# EasyEDA Pro project ProProject_Driver_STM32F405_2023-10-07.epro, board PCB1_4
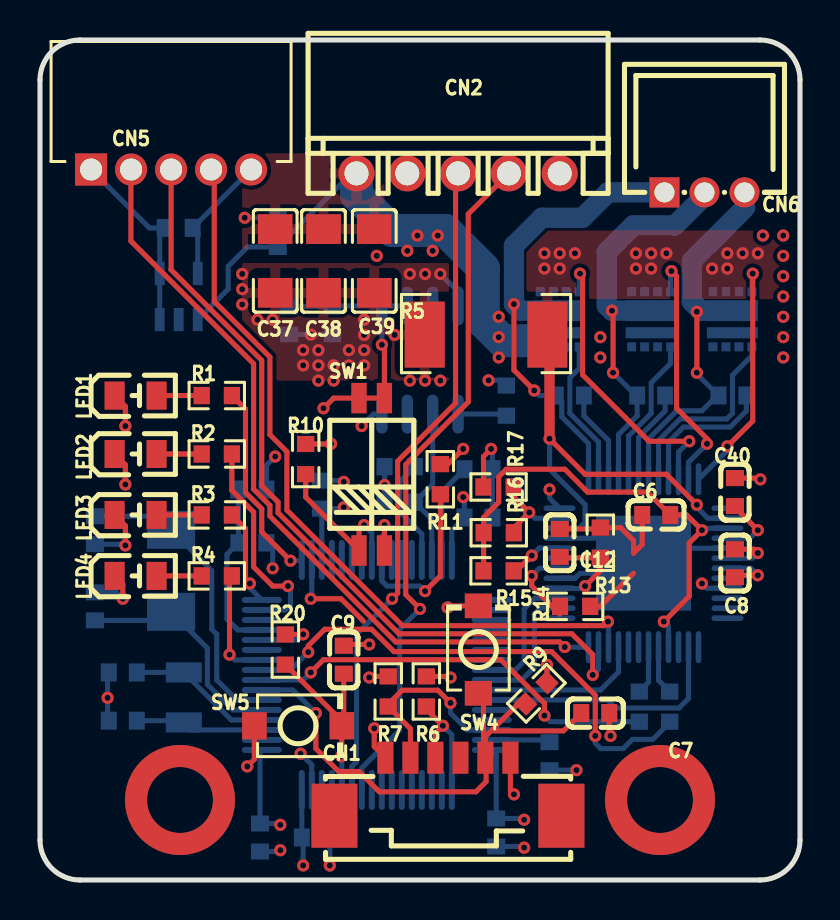
[diagram p8: board, top side]
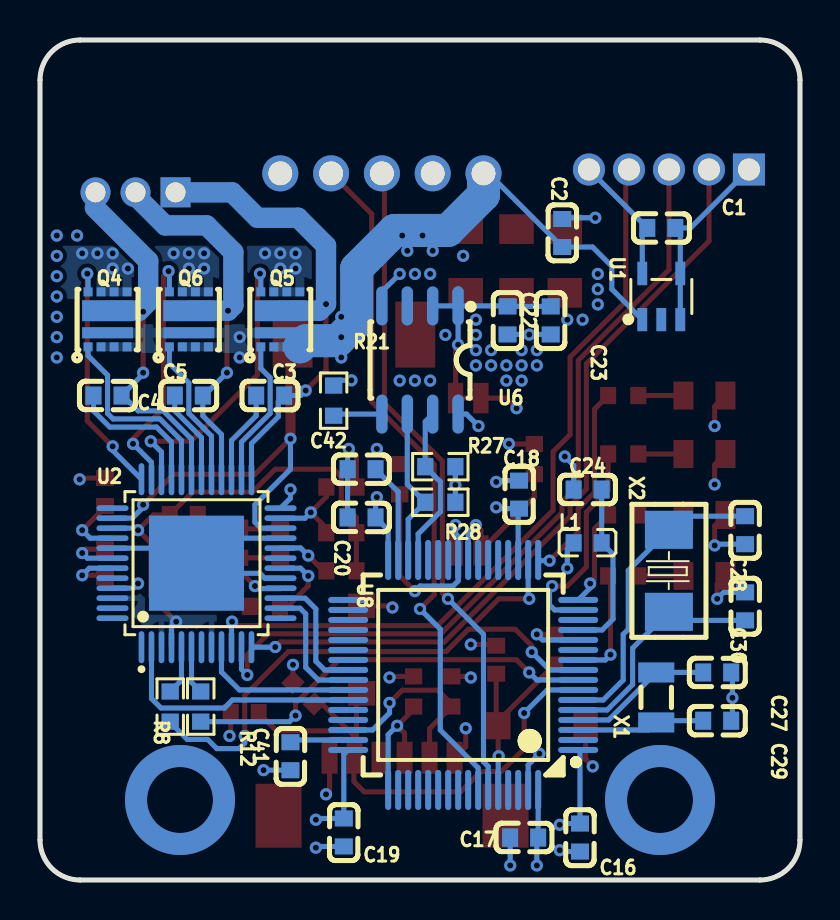
[diagram p9: board, bottom side, seen from below]

Outline 38 x 42 mm; copper layers: Top Layer, Inner1, Inner2, Bottom Layer. Coordinates in mm from the lower left corner of the outline.
Outline path: 0,40 0,2 arc(0.59,0.59) 2,0 36,0 arc(37.41,0.59) 38,2 38,40 arc(37.41,41.41) 36,42 2,42 arc(0.59,41.41) 0,40
Stack: Top Layer 0.035mm / Dielectric1 0.48mm PP er 4.5 / Inner1 0.035mm / Dielectric2 0.48mm FR4 er 4.5 / Inner2 0.035mm / Dielectric3 0.48mm PP er 4.5 / Bottom Layer 0.035mm

## Design rules (mm)
spacing safeClearance (default): track to track 0.152, other pairs 0.152 to 0.3
track width trackWidth (default): min 0.127, default 0.254, max 2.54
differential pair differentialPair (default): width min 0.127, default 0.254, max 2.54; gap min 0.152, default 0.152
via viaSize (default): diameter min 0.5, default 0.61, max 10; hole min 0.3, default 0.305, max 6
net GND uses copperRegion1
net VCC uses copperRegion1
net $1N23481 uses copperRegion1
net GND_CS uses copperRegion1
net +16V uses copperRegion1

## Placement (name value [footprint] x y rotation side)
C1  4.7uF  [C0603]  6.94 32.6 0 bottom
C2  10uF  [C0603]  11.89 32.35 270 bottom
C3  33nF  [C0603]  26.49 24.22 180 bottom
C4  33nF  [C0603]  34.62 24.22 180 bottom
C5  33nF  [C0603]  30.56 24.22 180 bottom
C6  1uF  [C0603]  30.81 18.25 0 top
C7  100nF  [C0603]  27.76 8.35 180 top
C8  470nF  [C0603]  34.75 15.84 270 top
C9  100nF  [C0603]  15.19 11.01 90 top
C12  1nF  [C0603]  25.99 16.86 270 top
C16  100nF  [C0603]  11 2.12 90 bottom
C17  100nF  [C0603]  13.79 2.12 180 bottom
C18  100nF  [C0603]  14.05 19.27 270 bottom
C19  100nF  [C0603]  22.81 2.38 90 bottom
C20  100nF  [C0603]  21.92 18.13 180 bottom
C22  10uF  [C0603]  14.62 27.98 90 bottom
C23  100nF  [C0603]  12.46 27.98 90 bottom
C24  100nF  [C0603]  10.62 19.52 180 bottom
C27  20pF  [C0603]  4.14 10.38 0 bottom
C28  20pF  [C0603]  2.74 17.49 90 bottom
C29  20pF  [C0603]  4.14 7.97 0 bottom
C30  20pF  [C0603]  2.74 13.68 270 bottom
C37  10uF  [C1206]  11.76 30.95 90 top
C38  10uF  [C1206]  14.17 30.95 90 top
C39  10uF  [C1206]  16.71 30.95 90 top
C40  1uF  [C0603]  34.75 19.4 90 top
C41  2.2uF  [C0603]  25.48 6.19 90 bottom
C42  2.2uF  [C0603]  21.92 20.54 180 bottom
CN1  532610671  [CONN-SMD_6P-P1.25_53261-0671]  20.4 4.66 0 top
CN2  5264-5AWD米色  [CONN-TH_5P-P2.50_5264-5AWD]  20.91 36.03 0 top
CN5  PH-5AW  [CONN-TH_5P-P2.00_PH-5AW_C2908637]  6.55 35.53 0 top
CN6  PH-3AW  [CONN-TH_3P-P2.00_HCTL_PH-3AW_C2908635]  33.22 34.38 180 top
L1  3.3uH  [L0603]  10.62 16.86 180 bottom
LED1  SZYY0805B  [LED0805-R-RD_BLUE]  4.78 24.22 0 top
LED2  SZYY0805B  [LED0805-R-RD_BLUE]  4.78 21.3 0 top
LED3  SZYY0805B  [LED0805-R-RD_BLUE]  4.78 18.25 0 top
LED4  SZYY0805B  [LED0805-R-RD_BLUE]  4.78 15.2 0 top
Q4  DMT3009LDT-7  [V-DFN3030-8K_L3.0-W3.0-P0.65-BL]  34.62 28.03 180 bottom
Q5  DMT3009LDT-7  [V-DFN3030-8K_L3.0-W3.0-P0.65-BL]  25.99 28.03 180 bottom
Q6  DMT3009LDT-7  [V-DFN3030-8K_L3.0-W3.0-P0.65-BL]  30.56 28.03 180 bottom
R1  1kΩ  [R0603]  8.84 24.22 0 top
R2  1kΩ  [R0603]  8.84 21.3 0 top
R3  1kΩ  [R0603]  8.84 18.25 0 top
R4  1kΩ  [R0603]  8.84 15.2 0 top
R5  25mΩ  [RES-SMD_L6.4-W3.2-R2512]  22.3 27.27 0 top
R6  10kΩ  [R0603]  19.32 9.43 270 top
R7  10kΩ  [R0603]  17.41 9.43 270 top
R8  1kΩ  [R0603]  31.49 8.67 90 bottom
R9  10kΩ  [R0603]  24.82 9.34 45 top
R10  806kΩ  [R0603]  13.28 21.05 90 top
R11  806kΩ  [R0603]  20.02 20.04 90 top
R12  1kΩ  [R0603]  29.96 8.67 90 bottom
R13  47kΩ  [R0603]  28.02 16.86 270 top
R14  10kΩ  [R0603]  26.76 13.68 0 top
R15  100kΩ  [R0603]  22.93 15.46 0 top
R16  100kΩ  [R0603]  22.94 17.36 0 top
R17  10kΩ  [R0603]  22.93 19.65 0 top
R20  10kΩ  [R0603]  12.27 11.52 90 top
R21  1kΩ  [R0603]  23.32 23.97 270 bottom
R27  10kΩ  [R0603]  17.98 20.67 180 bottom
R28  10kΩ  [R0603]  17.98 18.89 180 bottom
SW1  DSHP02TSGER  [SW-SMD_DSHP02TSGER]  16.59 20.28 0 top
SW4  TS-1088-AR02016  [SW-SMD_L3.9-W3.0-P4.45]  21.92 11.52 90 top
SW5  TS-1088-AR02016  [SW-SMD_L3.9-W3.0-P4.45]  12.9 7.71 0 top
U1  TPS7B6950DBVR  [SOT-23-5_L3.0-W1.7-P0.95-LS2.8-BL]  6.94 29.17 180 bottom
U2  A3930KJPTR-T  [LQFP-48_L7.0-W7.0-P0.50-LS9.0-BL-EP]  30.18 15.84 180 bottom
U6  AS5600-ASOT  [SOIC-8_L5.0-W4.0-P1.27-LS6.0-BL]  19 26 0 bottom
U8  STM32F405RGT6  [LQFP-64_L10.0-W10.0-P0.50-LS12.0-BL]  16.84 10.25 90 bottom
X1  32.768kHz  [FC-135R_L3.2-W1.5]  7.19 9.13 270 bottom
X2  8MHz  [CRYSTAL-SMD_L5.0-W3.2]  6.55 15.46 270 bottom

## Footprints (pads in the part's own frame, mm; a bottom-side part is the same pattern mirrored in y, then rotated)
C0603
  rect 0.8x0.9 smd: 1(-0.7,0) 2(0.7,0)
C1206
  rect 1.485x1.728 smd: 1(-1.593,0) 2(1.593,0)
CONN-SMD_6P-P1.25_53261-0671
  rect 0.8x1.6 smd: 1(3.124,1.45) 2(1.875,1.45) 3(0.625,1.45) 4(-0.625,1.45) 5(-1.875,1.45) 6(-3.124,1.45)
  rect 2.301x3.2 smd: 7(-5.675,-1.45) 8(5.675,-1.45)
CONN-TH_3P-P2.00_HCTL_PH-3AW_C2908635
  rect 1.5x1.5 hole 1: 1(2.001,0)
  round 1.5 hole 1: 2(0,0) 3(-2.001,0)
CONN-TH_5P-P2.00_PH-5AW_C2908637
  rect 1.6x1.6 hole 1.1: 1(-4,0)
  round 1.6 hole 1.1: 2(-2,0) 3(0,0) 4(2,0) 5(4,0)
CONN-TH_5P-P2.50_5264-5AWD
  round 1.801 hole 1.199: 1(-5.08,-0.701) 2(-2.54,-0.701) 3(0,-0.701) 4(2.54,-0.701) 5(5.08,-0.701)
CRYSTAL-SMD_L5.0-W3.2
  rect 1.9x2.4 smd: 1(-2.05,0) 2(2.05,0)
FC-135R_L3.2-W1.5
  rect 1x1.8 smd: 1(-1.25,0) 2(1.25,0)
L0603
  rect 0.8x0.864 smd: 1(-0.7,0) 2(0.7,0)
LED0805-R-RD_BLUE
  rect 1.001x1.399 smd: 1(1.052,0) 2(-1.049,0)
LQFP-48_L7.0-W7.0-P0.50-LS9.0-BL-EP
  oval 0.28x1.6 smd: 1(-2.75,-4.2) 2(-2.25,-4.2) 3(-1.75,-4.2) 4(-1.25,-4.2) 5(-0.75,-4.2) 6(-0.25,-4.2) 7(0.25,-4.2) 8(0.75,-4.2) 9(1.25,-4.2) 10(1.75,-4.2) 11(2.25,-4.2) 12(2.75,-4.2) 25(2.75,4.2) 26(2.25,4.2) 27(1.75,4.2) 28(1.25,4.2) 29(0.75,4.2) 30(0.25,4.2) 31(-0.25,4.2) 32(-0.75,4.2) 33(-1.25,4.2) 34(-1.75,4.2) 35(-2.25,4.2) 36(-2.75,4.2)
  oval 1.6x0.28 smd: 13(4.2,-2.75) 14(4.2,-2.25) 15(4.2,-1.75) 16(4.2,-1.25) 17(4.2,-0.75) 18(4.2,-0.25) 19(4.2,0.25) 20(4.2,0.75) 21(4.2,1.25) 22(4.2,1.75) 23(4.2,2.25) 24(4.2,2.75) 37(-4.2,2.75) 38(-4.2,2.25) 39(-4.2,1.75) 40(-4.2,1.25) 41(-4.2,0.75) 42(-4.2,0.25) 43(-4.2,-0.25) 44(-4.2,-0.75) 45(-4.2,-1.25) 46(-4.2,-1.75) 47(-4.2,-2.25) 48(-4.2,-2.75)
  rect 4.75x4.75 smd: 49(0,0)
LQFP-64_L10.0-W10.0-P0.50-LS12.0-BL
  oval 0.3x2 smd: 1(-3.75,-5.75) 2(-3.25,-5.75) 3(-2.75,-5.75) 4(-2.25,-5.75) 5(-1.75,-5.75) 6(-1.25,-5.75) 7(-0.75,-5.75) 8(-0.25,-5.75) 9(0.25,-5.75) 10(0.75,-5.75) 11(1.25,-5.75) 12(1.75,-5.75) 13(2.25,-5.75) 14(2.75,-5.75) 15(3.25,-5.75) 16(3.75,-5.75) 33(3.75,5.75) 34(3.25,5.75) 35(2.75,5.75) 36(2.25,5.75) 37(1.75,5.75) 38(1.25,5.75) 39(0.75,5.75) 40(0.25,5.75) 41(-0.25,5.75) 42(-0.75,5.75) 43(-1.25,5.75) 44(-1.75,5.75) 45(-2.25,5.75) 46(-2.75,5.75) 47(-3.25,5.75) 48(-3.75,5.75)
  oval 2x0.3 smd: 17(5.75,-3.75) 18(5.75,-3.25) 19(5.75,-2.75) 20(5.75,-2.25) 21(5.75,-1.75) 22(5.75,-1.25) 23(5.75,-0.75) 24(5.75,-0.25) 25(5.75,0.25) 26(5.75,0.75) 27(5.75,1.25) 28(5.75,1.75) 29(5.75,2.25) 30(5.75,2.75) 31(5.75,3.25) 32(5.75,3.75) 49(-5.75,3.75) 50(-5.75,3.25) 51(-5.75,2.75) 52(-5.75,2.25) 53(-5.75,1.75) 54(-5.75,1.25) 55(-5.75,0.75) 56(-5.75,0.25) 57(-5.75,-0.25) 58(-5.75,-0.75) 59(-5.75,-1.25) 60(-5.75,-1.75) 61(-5.75,-2.25) 62(-5.75,-2.75) 63(-5.75,-3.25) 64(-5.75,-3.75)
R0603
  rect 0.806x0.864 smd: 1(-0.753,0) 2(0.753,0)
RES-SMD_L6.4-W3.2-R2512
  rect 2x3.3 smd: 1(-3.067,0) 2(3.067,0)
SOIC-8_L5.0-W4.0-P1.27-LS6.0-BL
  oval 0.569x1.95 smd: 1(-1.905,-2.705) 2(-0.635,-2.705) 3(0.635,-2.705) 4(1.905,-2.705) 5(1.905,2.705) 6(0.635,2.705) 7(-0.635,2.705) 8(-1.905,2.705)
SOT-23-5_L3.0-W1.7-P0.95-LS2.8-BL
  rect 0.49x1.157 smd: 1(-0.95,-1.153) 2(0,-1.153) 3(0.95,-1.153)
  rect 0.49x1.175 smd: 4(0.95,1.153) 5(-0.95,1.153)
SW-SMD_DSHP02TSGER
  rect 0.762x1.524 smd: 1(-0.635,-3.81) 2(0.635,-3.81) 3(0.635,3.81) 4(-0.635,3.81)
SW-SMD_L3.9-W3.0-P4.45
  rect 1.23x1.36 smd: 1(-2.185,0) 2(2.185,0)
V-DFN3030-8K_L3.0-W3.0-P0.65-BL
  rect 0.45x0.45 smd: 1(-0.975,-1.375) 2(-0.325,-1.375) 3(0.325,-1.375) 4(0.975,-1.375) 5(0.975,1.375) 6(0.325,1.375) 7(-0.325,1.375) 8(-0.975,1.375)
  rect 2.55x1.044 smd: 9(0,0.433)
  rect 2.55x0.556 smd: 10(0,-0.672)

## Nets
As in the schematic.

Pads without a net: CN1 3 7 8; U1 2; U2 1 7 13 19 37 44 47 48; U6 3; U8 2 11 20 22 23 26 27 33 34 35 36 37 38 39 44 45 50 51 52 53 54 55 56 57 61 62

## Via types
v1: diameter 5.5, hole 3.3, Top Layer to Bottom Layer, 2 vias
v2: diameter 0.61, hole 0.305, Top Layer to Bottom Layer, 143 vias

## Routing (per net, layer and track width the routed paths; a pad name or vN(x,y) marks a point on that pad's centre or on a via; arc(x,y) is an arc through that point)
+5V: length 6.5
  Bottom Layer w0.254: CN5.5 C1.2 7.88,32.35 U1.5
+16V: length 58.5
  Inner2 w0.254: v2(33.1,14.82) 28.4,19.52 v2(25.48,19.52)
  Inner2 w0.508: v2(25.48,19.52) 25.48,20.92 15.82,30.57 CN2.1
  Bottom Layer w0.254: v2(33.1,14.82) 33.33,14.59 U2.45 ; U2.24 25.48,19.09 v2(25.48,19.52) ; CN2.1 15.57,35.33 C2.2 10.37,31.65 9.41,30.69 9.41,29.55 U1.1
  Bottom Layer w1.651: CN2.1 15.82,34.25 17.6,32.48 20.27,32.48 22.17,30.58 22.17,27.91 23.12,26.97 24.7,26.97 Q5.4
  vias: v2(16.84,31.21) v2(18.37,31.46) v2(18.87,32.22) v2(19.63,31.46) v2(19.89,32.22) v2(22.94,28.16) v2(22.94,27.14) v2(22.94,26.13) v2(28.02,27.14) v2(28.02,26.13) v2(36.15,32.22) v2(37.16,32.22) v2(37.16,31.21) v2(37.16,30.19) v2(37.16,29.17) v2(37.16,28.16) v2(37.16,27.14) v2(37.16,26.13)
GND: length 86
  Top Layer w0.254: v2(13.54,14.06) 15.05,14.06 16.17,12.94 ; C12.1 28.28,17.56 28.34,17.62 ; v2(21.16,21.56) 20.4,20.79 R11.2 ; v2(20.52,10.12) 20.47,10.18 R6.1 ; 20.52,13.68 20.55,13.71 SW4.2 ; C9.2 15.25,11.78 v2(16.46,11.78) ; v2(4.27,19.78) 4.27,20.76 LED2.2 ; 29.68,15.34 28.02,13.68 R14.2 ; R10.2 14.55,21.8 v2(14.56,21.81) ; v2(4.14,14.06) 4.14,14.79 LED4.2 ; v2(28.53,7.2) 28.46,7.27 C7.1 ; v2(4.27,16.73) 4.27,17.71 LED3.2 ; v2(22.56,21.56) 22.18,21.17 R17.1 ; 28.34,17.62 R13.1 ; 28.34,17.62 29.03,17.62 29.68,16.97 29.68,16.34 30.11,16.78 C6.1 ; v2(36.02,20.03) 35.95,20.1 C40.2 ; CN1.6 16.71,6.67 v2(16.71,7.58) ; v2(13.16,12.28) 13.15,12.28 R20.2 ; LED1.2 4.27,23.68 v2(4.27,22.7)
  Bottom Layer w0.254: U8.18 13.59,14.11 v2(13.54,14.06) ; C2.1 11.83,33.11 v2(10.24,33.11) ; v2(14.49,0.73) 14.49,0.73 C17.1 ; U8.12 12.88,12 v2(13.16,12.28) ; CN5.1 5.47,32.6 C1.1 5.99,32.35 U1.4 U1.3 ; U2.21 28.93,17.09 29.68,16.34 ; U2.17 26.76,15.09 27,15.33 29.67,15.33 29.68,15.34 ; C29.1 3.38,8.03 v2(3.38,9.11) 3.38,10.32 C27.1 ; v2(15.19,19.9) 15.12,19.97 14.05,19.97 ; C16.1 11.95,1.42 v2(12.01,1.49) ; v2(20.02,30.3) 20.91,29.41 U6.4 ; v2(11.76,21.17) 11.32,20.73 C24.1 ; U6.8 16.68,23.3 v2(16.08,22.7) ; R21.1 23.06,24.98 v2(22.43,24.98) ; C28.1 4.21,16.79 v2(4.27,16.73) ; v2(24.21,1.62) 24.15,1.68 C19.1 ; C30.1 3.82,14.38 v2(4.14,14.06) ; U8.63 13.59,5.75 v2(13.03,6.31) ; C20.1 C42.1 22.62,21.49 v2(22.56,21.56) ; C41.1 25.48,5.49 v2(26.82,5.49) ; C23.1 C22.1 ; U2.41 30.93,16.59 30.68,16.34
  vias: v2(10.11,30.3) v2(10.11,29.54) v2(10.11,28.78) v2(10.87,28.02) v2(11.63,28.02) v2(13.16,26.49) v2(13.16,25.73) v2(13.54,27.27) v2(13.92,26.49) v2(13.92,25.73) v2(13.92,24.97) v2(14.68,25.73) v2(14.68,24.97) v2(15.44,26.49) v2(15.44,25.73) v2(16.21,28.02) v2(16.21,27.25) v2(16.21,26.49) v2(16.21,25.73) v2(17.73,27.25) v2(18.49,30.3) v2(18.49,24.97) v2(19.25,30.3) v2(19.25,24.97) v2(20.02,24.97) v2(20.38,13.62)
GND_CS: length 22.2
  Top Layer w0.254: v2(32.84,18.76) 31.32,20.28 27.25,20.28 v2(25.48,22.06)
  Top Layer w0.508: R5.2 25.48,27.16 v2(25.48,22.06)
  Bottom Layer w0.254: U2.22 26.95,17.59 27.25,17.89 27.25,18.76 25.48,20.54 v2(25.48,22.06) ; U2.38 33.39,18.09 32.84,18.63 v2(32.84,18.76)
  vias: v2(25.22,31.33) v2(25.22,30.57) v2(25.99,31.33) v2(25.99,30.57) v2(26.75,31.33) v2(29.79,31.33) v2(29.79,30.57) v2(30.56,31.33) v2(30.56,30.57) v2(31.32,31.33) v2(33.6,30.57) v2(34.37,31.33) v2(34.37,30.57) v2(35.13,31.33) v2(35.89,31.33)
VCC: length 43.6
  Top Layer w0.254: CN1.1 23.52,4.46 v2(23.7,4.28) ; v2(25.35,10.76) R9.2 ; R7.1 16.51,10.18 v2(16.46,10.12) ; v2(10.36,5.68) 10.72,6.03 SW5.1 ; v2(17.09,26.76) 17.22,26.64 SW1.3 SW1.4 14.68,24.09 v2(14.17,23.59)
  Bottom Layer w0.254: U6.1 v2(17.09,26.76) ; U6.1 U6.2 ; U6.1 14.65,28.7 C22.2 C23.2 ; U8.32 20.59,17.5 C20.2 21.22,19.08 v2(21.16,19.14) ; U8.48 22.81,6.28 C19.2 24.14,3.08 v2(24.21,3.01) ; v2(13.16,0.73) 13.16,2.06 13.09,2.12 13.09,4.5 U8.64 ; U8.1 11,6.41 C16.2 11.95,2.82 v2(12.01,2.76) ; L1.1 11.63,16.54 v2(11.63,15.59) ; v2(15.19,18.63) 15.12,18.57 C18.2 14.09,18.53 U8.19 ; R28.2 v2(17.23,19.75) R27.2
VDDA: length 8.7
  Bottom Layer w0.254: U8.13 9.89,12.5 9.35,13.05 9.35,16.29 L1.2 C24.2
(no net):
  vias: v1(7,4) v1(31,4)
A_OUT: length 19.1
  Top Layer w0.254: v2(32.84,25.36) v2(32.84,28.41)
  Bottom Layer w0.254: U2.31 30.43,22.05 31.84,23.46 33.1,23.46 33.86,24.22 33.92,24.22 32.84,25.3 v2(32.84,25.36)
  Bottom Layer w1.016: 35.26,33.62 32.59,30.95 32.59,28.92 33.04,28.47 Q4.9
ADDRESS1: length 11.6
  Top Layer w0.254: SW1.2 v2(17.22,17.75) ; v2(19.25,14.44) 20.02,15.2 R11.1
  Bottom Layer w0.254: v2(17.22,17.75) 17.22,17.31 17.09,17.18 U8.25 17.09,14.95 17.35,14.7 19,14.7 v2(19.25,14.44)
ADDRESS2: length 8.2
  Top Layer w0.254: v2(16.21,17.75) 15.95,17.49 SW1.1 13.28,19.14 R10.1
  Bottom Layer w0.254: v2(16.21,17.75) 16.59,17.36 U8.24
B_OUT: length 20.5
  Top Layer w0.254: v2(28.65,25.36) 28.65,28.41
  Bottom Layer w0.254: U2.28 28.93,22.28 29.86,23.21 C5.2 29.79,24.22 v2(28.65,25.36)
  Bottom Layer w1.016: Q6.9 v2(28.6,28.47) 28.33,28.73 28.33,31.4 29.67,32.73 31.74,32.73 33.22,34.22 CN6.2
BOOT0: length 10.1
  Top Layer w0.254: C9.1 15.19,7.81 SW5.2 ; SW5.2 15.09,7.95 R20.1 ; SW5.2 15.09,6.21 v2(15.06,6.19)
  Bottom Layer w0.254: U8.60 15.09,6.16 v2(15.06,6.19)
C_OUT: length 24.8
  Top Layer w0.254: v2(23.7,28.79) 23.7,25.49 v2(24.72,24.48)
  Bottom Layer w0.254: v2(24.72,24.48) 24.97,24.22 C3.2 26.09,23.93 26.09,23.16 27.43,21.82 U2.25
  Bottom Layer w1.016: Q5.9 24.03,28.47 v2(23.7,28.79) 23.7,31.72 25.1,33.11 27.13,33.11 28.4,34.38 CN6.1
CA: length 7.2
  Bottom Layer w0.254: C4.1 35.32,23.46 34.51,22.65 32.17,22.65 31.43,21.9 U2.33
CB: length 4.7
  Bottom Layer w0.254: U2.30 29.93,22.13 31.26,23.46 C5.1
CC: length 4.7
  Bottom Layer w0.254: U2.27 28.43,21.97 27.19,23.21 C3.1
DIR: length 7.9
  Bottom Layer w0.254: U8.42 28.03,9.5 28.93,10.4 U2.9
FF1: length 20.9
  Top Layer w0.254: v2(25.22,8.22) 25.22,8.83 23.04,11.01 14.17,11.01 v2(13.54,10.38)
  Bottom Layer w0.254: U8.8 13.16,10 v2(13.54,10.38) ; v2(25.22,8.22) 25.53,7.92 R12.1
FF2: length 25.9
  Top Layer w0.254: v2(13.41,11.39) 13.41,11.71 14.24,12.54 16.58,12.54 17.69,11.42 25.58,11.42 27.76,9.24 v2(27.76,7.2)
  Bottom Layer w0.254: R8.1 31.49,7.88 30.64,7.03 29.62,7.03 29.16,6.57 28.04,6.57 27.76,6.84 v2(27.76,7.2) ; U8.9 12.52,10.5 v2(13.41,11.39)
GHA: length 9.9
  Bottom Layer w0.254: U2.32 30.93,21.98 32,23.05 34.34,23.05 34.62,23.33 34.62,25.24 35.6,26.21 Q4.1
GHB: length 7.5
  Bottom Layer w0.254: U2.29 29.43,22.2 30.56,23.33 30.56,24.86 31.53,25.83 Q6.1
GHC: length 7.4
  Bottom Layer w0.254: U2.26 27.93,21.9 26.49,23.33 26.49,25.11 26.96,25.58 Q5.1
GLA: length 12.3
  Top Layer w0.254: v2(34.37,21.68) 35.64,22.95 v2(35.64,30.32)
  Bottom Layer w0.254: v2(35.64,30.32) 35.6,30.28 Q4.8 ; v2(34.37,21.68) 34.37,21.48 U2.36
GLB: length 12.6
  Top Layer w0.254: v2(33.35,21.81) 33.35,22.06 31.83,23.59 31.83,30.19 v2(31.57,30.44)
  Bottom Layer w0.254: v2(33.35,21.81) 32.43,20.88 U2.35 ; Q6.8 31.53,30.4 v2(31.57,30.44)
GLC: length 14.9
  Top Layer w0.254: v2(27,30.32) 27.13,30.19 27.13,25.26 30.45,21.94 v2(32.46,21.94)
  Bottom Layer w0.254: Q5.8 26.96,30.28 v2(27,30.32) ; U2.34 31.93,21.4 v2(32.46,21.94)
HA: length 38.4
  Top Layer w0.254: v2(28.4,12.92) 28.19,12.72 18.12,12.72 12.35,18.49 12.35,21.42 11.49,22.27 11.49,26.15 8.71,28.93 8.71,35.37 CN5.4
  Bottom Layer w0.254: U2.10 28.43,12.89 v2(28.4,12.92)
HB: length 40.6
  Top Layer w0.254: v2(27.64,10.25) 27.64,11.27 26.59,12.31 17.95,12.31 11.9,18.36 11.9,18.9 11.09,19.71 11.09,25.98 6.55,30.51 CN5.3
  Bottom Layer w0.254: v2(27.64,10.25) 27.93,10.54 U2.11
HC: length 38.9
  Top Layer w0.254: CN5.2 4.55,35.52 4.55,31.94 10.68,25.81 10.68,19.54 11.49,18.73 11.49,18.19 17.79,11.9 25.99,11.9 v2(26.24,11.65)
  Bottom Layer w0.254: U2.12 26.25,11.64 v2(26.24,11.65)
I2C1_SCL: length 34.5
  Top Layer w0.254: v2(19,13.55) 18.29,14.27 18.29,20.78 21.41,23.9 21.41,33.3 CN2.4
  Bottom Layer w0.254: v2(19,13.55) 17.98,12.54 17.98,7.5 16.09,5.61 U8.58
I2C1_SDA: length 33
  Top Layer w0.254: v2(17.6,14.06) 17.88,14.34 17.88,20.95 20.78,23.84 20.78,35.2 CN2.3
  Bottom Layer w0.254: U8.59 15.59,5.68 15.82,5.91 15.82,12.28 v2(17.6,14.06)
I2C2_SCL: length 8.2
  Bottom Layer w0.254: U6.7 18.74,22.92 R27.1 17.98,19.91 17.98,18.41 19.09,17.3 U8.29
I2C2_SDA: length 8
  Bottom Layer w0.254: U8.30 19.59,18.03 R28.1 19.63,19.79 U6.6
LED1: length 10.1
  Top Layer w0.254: R1.2 10.28,23.54 10.28,19.38 11.09,18.56 11.09,17.4 v2(12.52,15.97)
  Bottom Layer w0.254: U8.17 13.06,15.97 v2(12.52,15.97)
LED2: length 10.7
  Top Layer w0.254: R2.2 9.59,19.48 10.68,18.39 10.68,15.65 11.63,14.7 v2(12.4,14.7)
  Bottom Layer w0.254: U8.15 12.27,13.5 12.52,13.76 12.52,14.44 12.4,14.57 v2(12.4,14.7)
LED3: length 4.9
  Top Layer w0.254: v2(10.49,14.82) 10.28,15.04 10.28,17.57 R3.2
  Bottom Layer w0.254: U8.16 10.49,14.6 v2(10.49,14.82)
LED4: length 5.7
  Top Layer w0.254: R4.2 9.47,15.09 v2(9.47,11.27)
  Bottom Layer w0.254: U8.10 9.74,11 v2(9.47,11.27)
MOTOR_MODE: length 6.4
  Bottom Layer w0.254: U2.15 24.74,14.09 24.21,13.55 24.21,10.94 23.77,10.5 U8.40
MOTOR_RESET: length 12.8
  Bottom Layer w0.254: U8.43 28.38,9 28.78,8.6 31.95,8.6 32.43,9.07 U2.2
NRST: length 27.7
  Top Layer w0.254: CN1.2 22.3,6.08 22.3,4.92 21.79,4.41 16.97,4.41 15.95,5.43 14.94,5.43 13.79,6.57 v2(13.79,8.35) ; CN1.2 22.27,7.17 ; CN1.2 22.18,6.21 22.18,9.34 ; C7.2 26.17,7.46 22.68,7.46 ; 22.27,7.17 22.21,7.11 ; 22.27,7.17 24.21,9.11
  Bottom Layer w0.254: U8.7 12.64,9.5 v2(13.79,8.35)
OSC32_IN: length 6.4
  Bottom Layer w0.254: C29.2 7.1,7.97 X1.2 7.57,7.5 U8.3
OSC32_OUT: length 7.2
  Bottom Layer w0.254: U8.4 9.57,8 X1.1 C27.2
OSC_IN: length 11.6
  Bottom Layer w0.254: U8.5 9.64,8.5 8.37,9.77 8.37,11.59 X2.2 6.13,12.98 C30.2
OSC_OUT: length 15.2
  Bottom Layer w0.254: U8.6 9.84,9 8.84,10 8.84,12.28 8.59,12.54 8.59,15.48 X2.1 5.87,18.19 C28.2
PWM: length 6.4
  Bottom Layer w0.254: U8.41 22.59,10 24.08,10 24.72,10.63 24.72,13.31 25,13.59 U2.14
SWCLK: length 6.4
  Top Layer w0.254: CN1.4 19.77,7.34 v2(20.14,7.71) 19.32,8.54 R6.2
  Bottom Layer w0.254: U8.49 20.59,7.26 v2(20.14,7.71)
SWDIO: length 9.7
  Top Layer w0.254: CN1.5 18.52,7.56 R7.2 17.41,8.79 18.11,9.49 19.89,9.49 v2(20.52,8.86)
  Bottom Layer w0.254: v2(20.52,8.86) 20.52,8.35 21.37,7.5 U8.46
$1N4505: length 2.9
  Bottom Layer w0.254: U8.47 25.36,7 C41.2
$1N4511: length 5
  Bottom Layer w0.254: U8.31 20.09,19.41 C42.2
$1N21748: length 2.8
  Top Layer w0.254: v2(35.89,16.35) 35.7,16.54 C8.1
  Bottom Layer w0.254: v2(35.89,16.35) 35.63,16.09 U2.42
$1N21864: length 2.8
  Top Layer w0.254: C8.2 34.84,15.23 v2(35.89,15.23)
  Bottom Layer w0.254: v2(35.89,15.23) 35.54,15.59 U2.43
$1N22637: length 5.1
  Top Layer w0.254: C12.2 26.03,16.11 R13.2 28.02,15.46 v2(27.25,14.7)
  Bottom Layer w0.254: v2(27.25,14.7) 27.13,14.57 26,14.57 U2.16
$1N23232: length 3.4
  Top Layer w0.254: C40.1 34.75,18.63 v2(35.89,17.49)
  Bottom Layer w0.254: U2.40 35.49,17.09 v2(35.89,17.49)
$1N23481: length 24.7
  Top Layer w0.254: R15.1 22.18,15.47 R16.1 22.18,18.13 22.94,18.89 22.94,20.16 23.32,20.54 26.24,20.54 27.38,19.4 30.37,19.4 C6.2 32.34,18.25 v2(33.1,17.49) 32.46,16.86 32.46,14.19 v2(31.19,12.92)
  Bottom Layer w0.254: U2.4 31.43,12.69 v2(31.19,12.92) ; U2.39 33.32,17.59 33.22,17.49 v2(33.1,17.49)
$1N24997: length 2.8
  Top Layer w0.254: R15.2 23.83,15.46 v2(24.59,16.22)
  Bottom Layer w0.254: v2(24.59,16.22) 24.97,16.6 25.96,16.6 U2.20
$1N25176: length 4.6
  Top Layer w0.254: R17.2 23.68,19.16 v2(24.46,18.38) 23.69,17.61 R16.2
  Bottom Layer w0.254: U2.23 24.75,18.09 v2(24.46,18.38)
$1N27489: length 4
  Top Layer w0.254: v2(24.59,15.2) 24.59,14.71 25.99,13.3
  Bottom Layer w0.254: U2.18 24.97,15.59 v2(24.59,15.2)
$1N33277: length 2.4
  Bottom Layer w0.254: U6.5 23.24,23.3 R21.2
$1N35265: length 2.3
  Top Layer w0.254: 5.83,24.22 R1.1
$1N35679: length 2.3
  Top Layer w0.254: R2.1 5.83,21.3
$1N35970: length 2.3
  Top Layer w0.254: 5.83,18.25 R3.1
$1N38182: length 2.3
  Top Layer w0.254: 5.83,15.2 R4.1
$1N68839: length 2.4
  Bottom Layer w0.254: R8.2 30.93,9.99 U2.5
$1N68841: length 2.4
  Bottom Layer w0.254: R12.2 30.43,9.89 U2.6

## Copper pours and planes (outline as drawn; the poured copper is in the pictures)
+16V on Top Layer: 10.24,31.52 17.28,31.52 17.6,31.84 17.6,33.24 17.22,33.62 17.22,35.89 16.78,36.33 10.66,36.33 10.11,35.78 10.11,31.65 10.24,31.52
+16V on Bottom Layer: 24,27.79 36.15,27.79 36.15,26.35 24,26.35
+16V on Inner2: 15.82,32.78 38.81,32.78 38.81,25.11 15.82,25.11
GND on Top Layer: 10.11,30.85 20.78,30.85 20.78,24.97 10.11,24.97
GND on Inner1: 0.08,50.51 44.65,50.51 44.65,-2.83 0.08,-2.83
GND_CS on Top Layer: 37.29,29.18 37.29,32.47 37.29,32.48 25.4,32.48 24.32,31.4 24.32,25.5 24.46,25.36 26.52,25.36 26.52,29.05 37.16,29.05
GND_CS on Bottom Layer: 23.7,31.72 38.56,31.72 38.56,29.05 23.7,29.05
VCC on Inner2: -3.35,50.77 40.34,50.77 40.34,-0.29 -3.35,-0.29
$1N23481 on Bottom Layer: 29.16,13.43 29.16,10.82 32.43,10.82 32.43,12.3 33.72,13.59 35.26,13.59 35.26,14.44 33.1,14.45 32.08,13.43
